# EAGLE design Adafruit Feather RP2040 USB Host (EAGLE 9.6.2)
COMPANY: ADAFRUIT INDUSTRIES; DRAWN: KTOWN; REV: B

## Sheet 1 of 2
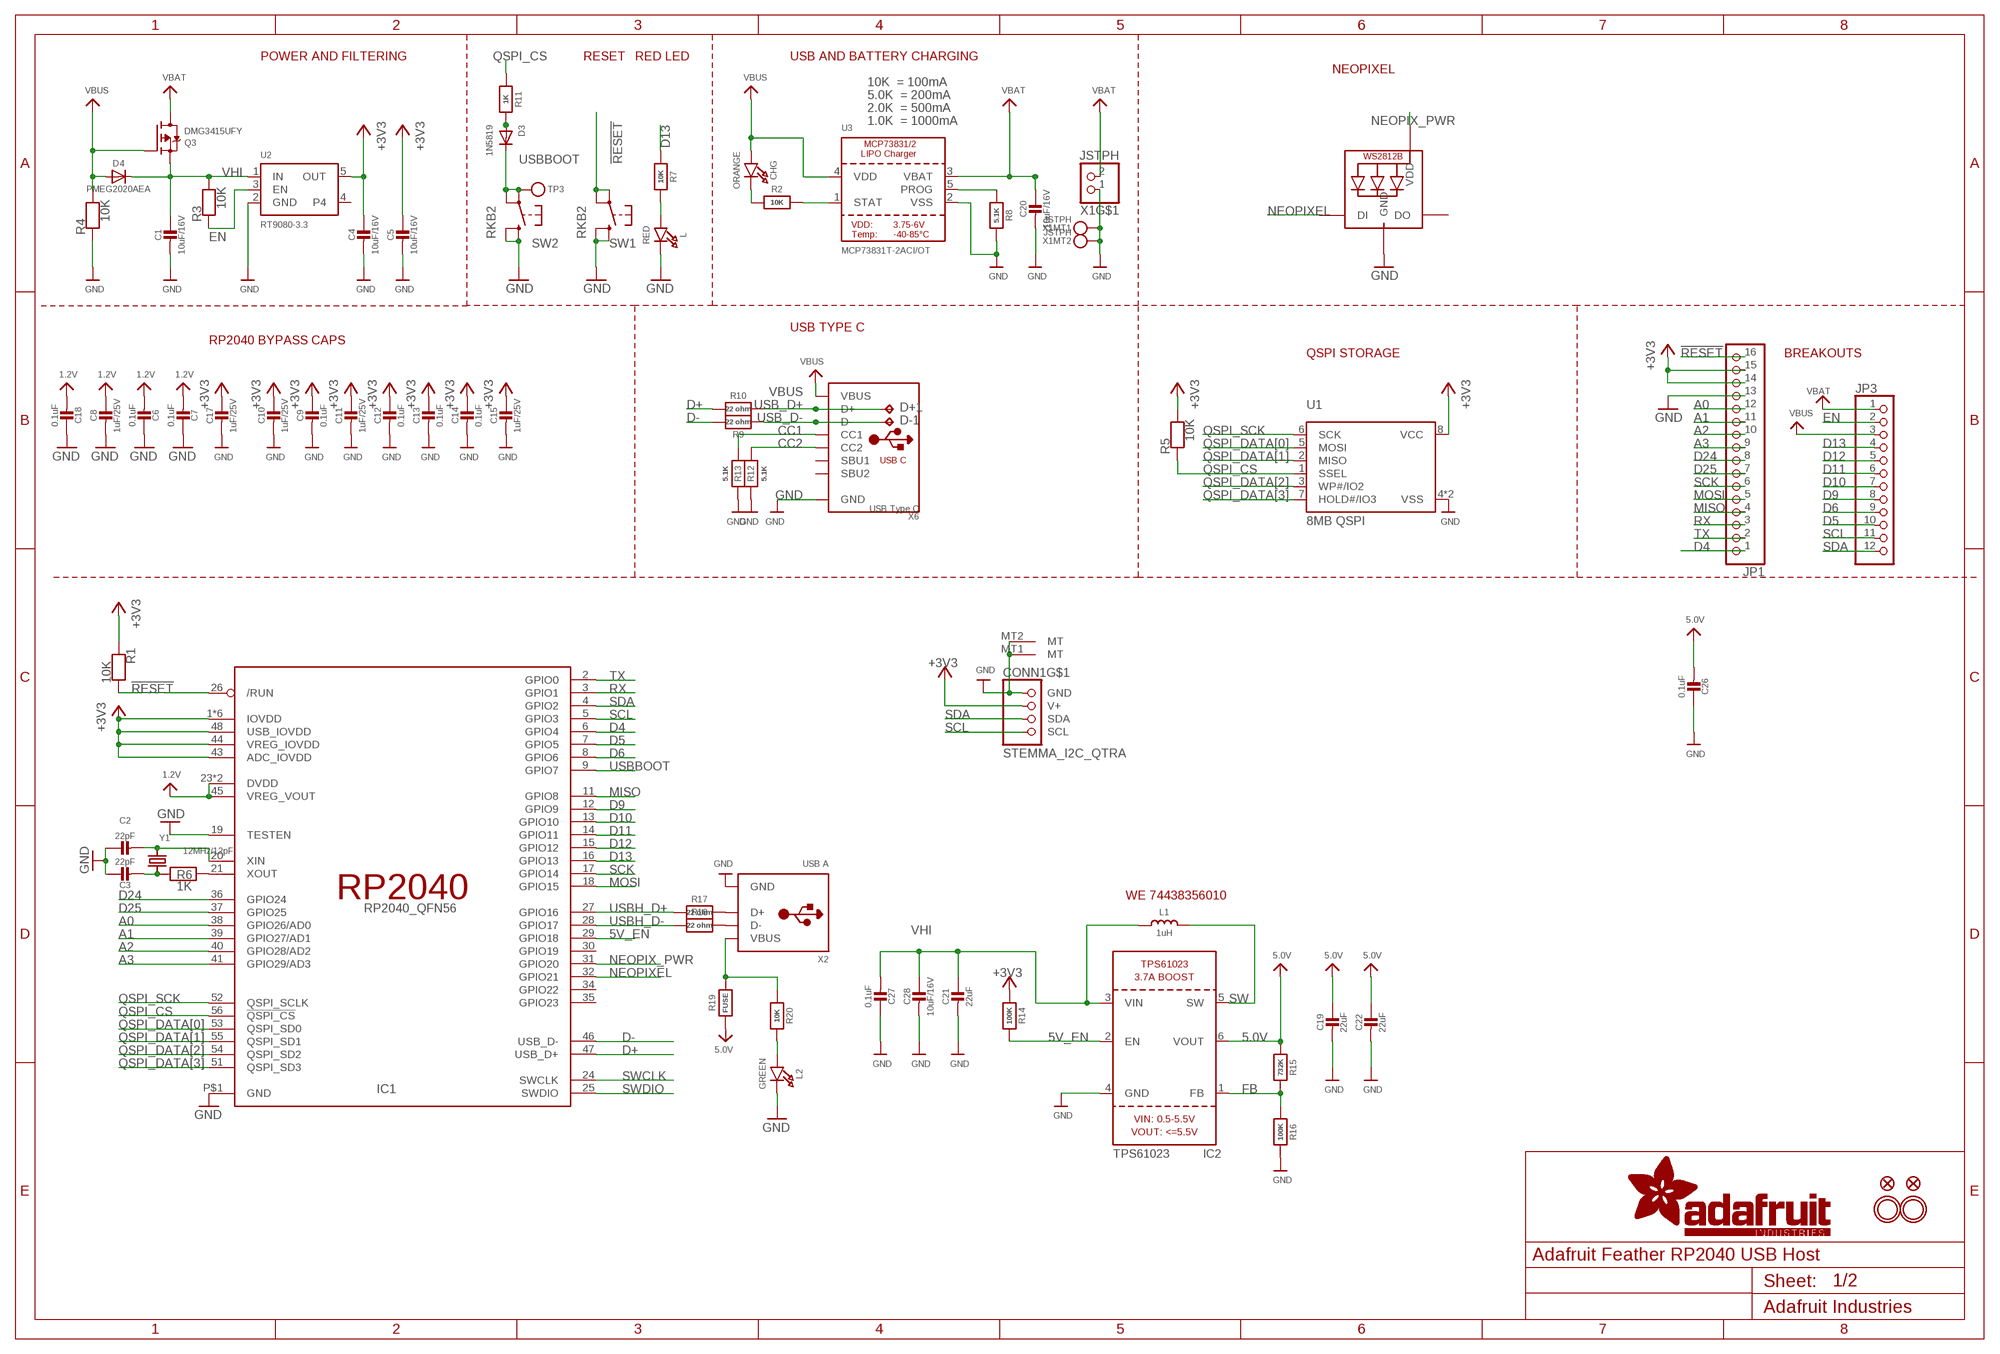
[diagram p0: schematic, sheet 1]

### Parts
C1  10uF/16V  CAP_CERAMIC0805-NOOUTLINE  [0805-NO]
C2  22pF  CAP_CERAMIC_0402NO  [_0402NO]
C3  22pF  CAP_CERAMIC_0402NO  [_0402NO]
C4  10uF/16V  CAP_CERAMIC0805-NOOUTLINE  [0805-NO]
C5  10uF/16V  CAP_CERAMIC0805-NOOUTLINE  [0805-NO]
C6  0.1uF  CAP_CERAMIC_0402NO  [_0402NO]
C7  0.1uF  CAP_CERAMIC_0402NO  [_0402NO]
C8  1uF/25V  CAP_CERAMIC_0402NO  [_0402NO]
C9  0.1uF  CAP_CERAMIC_0402NO  [_0402NO]
C10  1uF/25V  CAP_CERAMIC_0402NO  [_0402NO]
C11  1uF/25V  CAP_CERAMIC_0402NO  [_0402NO]
C12  0.1uF  CAP_CERAMIC_0402NO  [_0402NO]
C13  0.1uF  CAP_CERAMIC_0402NO  [_0402NO]
C14  0.1uF  CAP_CERAMIC_0402NO  [_0402NO]
C15  1uF/25V  CAP_CERAMIC_0402NO  [_0402NO]
C17  1uF/25V  CAP_CERAMIC_0402NO  [_0402NO]
C18  0.1uF  CAP_CERAMIC_0402NO  [_0402NO]
C19  22uF  CAP_CERAMIC0805-NOOUTLINE  [0805-NO]
C20  10uF/16V  CAP_CERAMIC0805-NOOUTLINE  [0805-NO]
C21  22uF  CAP_CERAMIC0805-NOOUTLINE  [0805-NO]
C22  22uF  CAP_CERAMIC0805-NOOUTLINE  [0805-NO]
C26  0.1uF  CAP_CERAMIC_0402NO  [_0402NO]
C27  0.1uF  CAP_CERAMIC_0402NO  [_0402NO]
C28  10uF/16V  CAP_CERAMIC0805-NOOUTLINE  [0805-NO]
CHG  ORANGE  LED0603_NOOUTLINE  [CHIPLED_0603_NOOUTLINE]
CONN1  STEMMA_I2C_QTRA  [JST_SH4_RA]
D3  1N5819  DIODE_SOD323MINI  [SOD-323_MINI]
D4  PMEG2020AEA  DIODESOD-323F  [SOD-323F]
D+1  TPB1,27  [B1,27]
D-1  TPB1,27  [B1,27]
IC1  RP2040_QFN56  [QFN56_7MM_REDUCEDEPAD]
IC2  TPS61023  [SOT563]
JP1  HEADER-1X16ROUND  [1X16_ROUND]
JP3  HEADER-1X12  [1X12_ROUND]
L  RED  LED0603_NOOUTLINE  [CHIPLED_0603_NOOUTLINE]
L1  1uH  INDUCTOR_5045_SMALLTABS  [INDUCTOR_5045_SMALLTABS]
L2  GREEN  LED0603_NOOUTLINE  [CHIPLED_0603_NOOUTLINE]
LED1  WS2812B_SK6805_1515  [SK6805_1515]
Q3  DMG3415UFY  MOSFET-P_DFN2015  [DFN2015-3]
R1  10K  RESISTOR_0402NO  [_0402NO]
R2  10K  RESISTOR_0402NO  [_0402NO]
R3  10K  RESISTOR_0402NO  [_0402NO]
R4  10K  RESISTOR_0402NO  [_0402NO]
R5  10K  RESISTOR_0402NO  [_0402NO]
R6  1K  RESISTOR_0402NO  [_0402NO]
R7  10K  RESISTOR_0402NO  [_0402NO]
R8  5.1K  RESISTOR_0402NO  [_0402NO]
R9  22 ohm  RESISTOR_0402NO  [_0402NO]
R10  22 ohm  RESISTOR_0402NO  [_0402NO]
R11  1K  RESISTOR_0402NO  [_0402NO]
R12  5.1K  RESISTOR_0402NO  [_0402NO]
R13  5.1K  RESISTOR_0402NO  [_0402NO]
R14  100K  RESISTOR_0402NO  [_0402NO]
R15  732K  RESISTOR_0402NO  [_0402NO]
R16  100K  RESISTOR_0402NO  [_0402NO]
R17  22 ohm  RESISTOR_0402NO  [_0402NO]
R18  22 ohm  RESISTOR_0402NO  [_0402NO]
R19  FUSE  RESISTOR0805_NOOUTLINE  [0805-NO]
R20  10K  RESISTOR_0402NO  [_0402NO]
SW1  RKB2  SWITCH_TACT_SMT_RKB2  [BTN_RKB2_4.6X2.8]
SW2  RKB2  SWITCH_TACT_SMT_RKB2  [BTN_RKB2_4.6X2.8]
TP3  TESTPOINTROUND1.5MMNO  [TESTPOINT_ROUND_1.5MM_NO]
U1  8MB QSPI  SPIFLASH_8PIN_4X4  [USON8_4X4]
U2  RT9080-3.3  VREG_SOT23-5  [SOT23-5]
U3  MCP73831T-2ACI/OT  MCP73831/2  [SOT23-5]
U$31  MOUNTINGHOLE2.5  [MOUNTINGHOLE_2.5_PLATED]
U$32  MOUNTINGHOLE2.5  [MOUNTINGHOLE_2.5_PLATED]
U$34  FIDUCIAL_1MM  [FIDUCIAL_1MM]
U$35  FIDUCIAL_1MM  [FIDUCIAL_1MM]
X1  JSTPH  CON_JST_PH_2PIN_MT_BATT  [JSTPH2_BATT]
X2  USB A  USB_TYPEA_SMT  [USB_HOST-SMT]
X6  USB Type C  USB_C  [USB_C_CUSB31-CFM2AX-01-X]
Y1  12MHz/12pF  CRYSTAL2.5X2.0  [CRYSTAL_2.5X2]

### Nets
1.2V: C6.2 C7.2 C8.1 C18.2 IC1.23(DVDD) IC1.45(VREG_VOUT) IC1.50(DVDD)
5.0V: C19.1 C22.1 C26.2 IC2.6(VOUT) R15.1 R19.2
5V_EN: IC1.29(GPIO18) IC2.2(EN) R14.2
!RESET: IC1.26(/RUN) JP1.16 R1.2 SW1.A'(P1) SW1.A(P)
+3V3: C4.1 C5.1 C9.1 C10.1 C11.1 C12.1 C13.1 C14.1 C15.1 C17.1 CONN1.2(V+) IC1.1(IOVDD) IC1.10(IOVDD) IC1.22(IOVDD) IC1.33(IOVDD) IC1.42(IOVDD) IC1.43(ADC_IOVDD) IC1.44(VREG_IOVDD) IC1.48(USB_IOVDD) IC1.49(IOVDD) JP1.14 JP1.15 R1.1 R5.2 R14.1 U1.8(VCC) U2.5(OUT)
A0: IC1.38(GPIO26/AD0) JP1.12
A1: IC1.39(GPIO27/AD1) JP1.11
A2: IC1.40(GPIO28/AD2) JP1.10
A3: IC1.41(GPIO29/AD3) JP1.9
CC1: R13.2 X6.A5(CC1)
CC2: R12.2 X6.B5(CC2)
D4: IC1.6(GPIO4) JP1.1
D5: IC1.7(GPIO5) JP3.10
D6: IC1.8(GPIO6) JP3.9
D9: IC1.12(GPIO9) JP3.8
D10: IC1.13(GPIO10) JP3.7
D11: IC1.14(GPIO11) JP3.6
D12: IC1.15(GPIO12) JP3.5
D13: IC1.16(GPIO13) JP3.4 R7.1
D24: IC1.36(GPIO24) JP1.8
D25: IC1.37(GPIO25) JP1.7
D+: IC1.47(USB_D+) R10.2
D-: IC1.46(USB_D-) R9.2
EN: JP3.2 R3.1 U2.3(EN)
FB: IC2.1(FB) R15.2 R16.1
GND [power]: C1.2 C2.1 C3.1 C4.2 C5.2 C6.1 C7.1 C8.2 C9.2 C10.2 C11.2 C12.2 C13.2 C14.2 C15.2 C17.2 C18.1 C19.2 C20.2 C21.2 C22.2 C26.1 C27.1 C28.2 CONN1.1(GND) CONN1.MT1(MT) CONN1.MT2(MT) IC1.19(TESTEN) IC1.P$1(GND) IC2.4(GND) JP1.13 L2.C L.C LED1.4(GND) R4.1 R8.2 R12.1 R13.1 R16.2 SW1.B'(S1) SW1.B(S) SW2.B'(S1) SW2.B(S) U1.4(VSS) U1.PAD(VSS) U2.2(GND) U3.2(VSS) X1.1 X1.NC1 X1.NC2 X2.GND X6.A1B12(GND) X6.B1A12(GND)
MISO: IC1.11(GPIO8) JP1.4
MOSI: IC1.18(GPIO15) JP1.5
N$1: CHG.C R2.1
N$2: L.A R7.2
N$3: R2.2 U3.1(STAT)
N$4: R8.1 U3.5(PROG)
N$5: C2.2 IC1.20(XIN) Y1.3
N$6: C3.2 R6.1 Y1.1
N$7: IC1.21(XOUT) R6.2
N$8: R17.1 X2.D+
N$9: R18.1 X2.D-
N$10: R19.1 R20.1 X2.VBUS
N$11: L2.A R20.2
N$16: D3.A R11.2
NEOPIX_PWR: IC1.31(GPIO20) LED1.2(VDD)
NEOPIXEL: IC1.32(GPIO21) LED1.1(DI)
QSPI_CS: IC1.56(!QSPI_CS) R5.1 R11.1 U1.1(SSEL)
QSPI_DATA[0]: IC1.53(QSPI_SD0) U1.5(MOSI)
QSPI_DATA[1]: IC1.55(QSPI_SD1) U1.2(MISO)
QSPI_DATA[2]: IC1.54(QSPI_SD2) U1.3(WP#/IO2)
QSPI_DATA[3]: IC1.51(QSPI_SD3) U1.7(HOLD#/IO3)
QSPI_SCK: IC1.52(QSPI_SCLK) U1.6(SCK)
RX: IC1.3(GPIO1) JP1.3
SCK: IC1.17(GPIO14) JP1.6
SCL: CONN1.4(SCL) IC1.5(GPIO3) JP3.11
SDA: CONN1.3(SDA) IC1.4(GPIO2) JP3.12
SW: IC2.5(SW) L1.2
SWCLK: IC1.24(SWCLK)
SWDIO: IC1.25(SWDIO)
TX: IC1.2(GPIO0) JP1.2
USB_D+: D+1.TP R10.1 X6.A6(D+) X6.B6(D+)
USB_D-: D-1.TP R9.1 X6.A7(D-) X6.B7(D-)
USBBOOT: D3.C IC1.9(GPIO7) SW2.A'(P1) SW2.A(P) TP3.P$1
USBH_D+: IC1.27(GPIO16) R17.2
USBH_D-: IC1.28(GPIO17) R18.2
VBAT [power]: C20.1 JP3.1 Q3.3(D) U3.3(VBAT) X1.2
VBUS [power]: CHG.A D4.A JP3.3 Q3.1(G) R4.2 U3.4(VDD) X6.A4B9(VBUS) X6.B4A9(VBUS)
VHI: C1.1 C21.1 C27.2 C28.1 D4.C IC2.3(VIN) L1.1 Q3.2(S) R3.2 U2.1(IN)
Unconnected: IC1.30(GPIO19) IC1.34(GPIO22) IC1.35(GPIO23) LED1.3(DO) U2.4 X6.A8(SBU1) X6.B8(SBU2)

### Notes on the sheet
- POWER AND FILTERING | RESET | RED LED | USB AND BATTERY CHARGING
- NEOPIXEL
- 10K  = 100mA
- 5.0K  = 200mA
- 2.0K  = 500mA
- 1.0K  = 1000mA
- USB TYPE C
- RP2040 BYPASS CAPS
- QSPI STORAGE | BREAKOUTS
- WE 74438356010

## Sheet 2 of 2

## Library data of the parts
C1-C3 C5-C15 C17-C22 C26-C28 = microbuilder:CAP_CERAMIC: Ceramic Capacitors For new designs, use the packages preceded by an '_' character since they are more reliable: The following footprints should be used on most boards: _0402 - Standard footprint for regular board layouts _0603 - Standard footprint for regular board layouts _0805 - Standard footprint for regular board layouts _1206 - Standard footprint for regular board layouts For extremely tight-pitch boards where space is at a premium, the following 'micro-pitch' footprints can be used (smaller pads, no silkscreen outline, etc.): _0402MP - Micro-pitch footprint for very dense/compact boards _0603MP - Micro-pitch footprint for very dense/compact boards _0805MP - Micro-pitch footprint for very dense/compact boards _1206MP - Micro-pitch footprint for very dense/compact boards
C4 = microbuilder:CAP_CERAMIC: Ceramic Capacitors For new designs, use the packages preceded by an '_' character since they are more reliable: The following footprints should be used on most boards: _0402 - Standard footprint for regular board layouts _0603 - Standard footprint for regular board layouts _0805 - Standard footprint for regular board layouts _1206 - Standard footprint for regular board layouts For extremely tight-pitch boards where space is at a premium, the following 'micro-pitch' footprints can be used (smaller pads, no silkscreen outline, etc.): _0402MP - Micro-pitch footprint for very dense/compact boards _0603MP - Micro-pitch footprint for very dense/compact boards _0805MP - Micro-pitch footprint for very dense/compact boards _1206MP - Micro-pitch footprint for very dense/compact boards; REV: A
CHG L L2 = microbuilder:LED: LED 0603 - 0603 Surface Mount Package 2mA: Green LED - Low Power (3.9mcd, 2ma, 1.7Vf) - Digikey: 475-2709-2-ND Orange LED - Low Power (9.8mcd, 2ma, 1.8Vf) - Digikey: 475-1194-2-ND Red LED - Low Power (5mcd, 2ma, 1.8Vf) - Digikey: 475-1195-2-ND Yellow LED - Low Power (7mcd, 2ma, 1.8Vf) - Digikey: 475-1196-2-ND 5mA: Blue LED - Low Power (17mcd, 5ma, 2.9Vf) - Digikey: LNJ937W8CRACT-ND 0805 - 0805 Surface Mount Package 2mA: Red LED (8.8mcd, 2mA, 1.8Vf, Clear) - Low Power [Digikey: 475-2510-1-ND] Green LED (5mcd, 2mA, 1.8Vf, Clear) - Low Power [Digikey: 475-2730-1-ND] Yellow LED (11.3mcd, 2mA, 1.8Vf, Clear) - Low Power [Digikey: 475-2555-1-ND] 20mA: Red LED (104mcd, 20mA, Diffused) - LS R976 [Digikey: 475-1278-6-ND] Red LED (12mcd, 20mA, 2.0Vf, Clear) - APT2012EC [Digikey: 754-1128-1-ND] Green LED (15mcd, 20mA, 2.2Vf, Clear) - APT2012GC [Digikey: 754-1131-1-ND] Orange LED (160mcd, 20mA, 2.1Vf, Clear) - APT2012SECK [Digikey: 754-1130-1-ND] 1206 - 1206 Surface Mount Package Green LED (26mcd, 20mA, Diffused) - LG N971 [Digikey: 475-1407-6-ND] Red LED (15mcd, 20mA, Diffused) - LH N974 [Digikey: 475-1416-6-ND] Cree - Cree High-Power Surface Mount LEDs XPEBWT-L1-0000-00D50 - White 111lm 350mA 2.9Vf 6200K 110° XTEAWT-00-0000-00000LEE3 - White 114lm 350mA 2.85Vf 5000K 115° Everlight - Everlight 45-21 Series Surface Mount LEDs 45-21/QK2C-B2832AC2CB2/2T - Warm White 2000mcd 20mA 3.25Vf 3050K 120° 45-21/LK2C-B38452C4CB2/2T - Nuetral White 2000mcd 20mA 3.25Vf 4150K 120° 45-21/LK2C-B50634C6CB2/2T - Cold White 2200mcd 20mA 3.25Vf 5650K 120° PLCC2 Reverse Mount LS T77K-J1L2-1-0-2-R18-Z - Red 11.25mcd 2mA 1.8Vf 630nm 120° LO T77K-L1M2-24-Z - Orange 19.6mcd 2mA 1.8Vf 606nm 120° LY T77K-K2M1-26-Z - Yellow 15.7mcd 2mA 1.8Vf 587nm 120°; ROT: 270
CONN1 = adafruit_electromech:STEMMA_I2C; LCSC: C145961
D3 = microbuilder:DIODE: Diode
D4 = adafruit:DIODE: Diode
D+1 D-1 = testpad:TP: Test pad
IC1 = adafruit_micro:RP2040; LCSC: C2040
IC2 = adafruit_power:TPS61023; ROT: 180
JP1 = microbuilder:HEADER-1X16: PIN HEADER
JP3 = microbuilder:HEADER-1X12
L1 = microbuilder:INDUCTOR: Inductors 0603: 10nH Ceramic Inductor - microwire antenna/RF (Digikey: 712-1434-2-ND) 0805: 560nH Ceramic Inductor - RF (Digikey: 553-1047-1-ND) 270nH Ceramic Inductor - Q = 40@250MHz, +-5%, 1 Ohm DC Resistance (Digikey: 535-10506-2-ND) 1007 (2518 Metric) SMT: 10µH 10% 250mOhm 820mA 1007 Inductor (Digikey: 587-2189-1-ND) 22µH 10% 500mOhm 580mA 1007 Inductor (Digikey: 587-2190-1-ND) 47µH 10% 950mOhm 420mA 1007 Inductor (Digikey: 587-2191-1-ND) 47µH 5% 100mOhm 1A 1008 Inductor (Digikey: 732-1816-1-ND) 5.0x5.0mm (Taiyo Yuden NR5040 Series) 6.8µH 20% 2.3A 64mOhm Inductor (Digikey: 587-2374-2-ND) 5.0x5.0mm (TDK VLC5045 Series) 4.7µH 20% 3.3A 34mOhm Inductor (Digikey: 445-6526-1-ND) 6.8µH 20% 2.7A 46mOhm Inductor (Digikey: 445-6527-1-ND) 6.0x6.0mm (TDK VLC6045 Series) 4.7µH 20% 3.8A 27mOhm Inductor (Digikey: 445-6538-2-ND) 6.8µH 20% 3A 41mOhm Inductor (Digikey: 445-6540-1-ND) 6.2µH 30% 2.2A 45mOhm Inductor (Digikey: SRR5028-6R2YCT-ND) - Not TDK VLC6045 but footprint should match 6.0x6.0mm (TDK SLF6045 Series) 6.8uH 30% 2A 33mOhm Inductor (Digikey: 445-4572-1-ND, Mouser: 810-SLF645T6R8N2R0PF) 6.0x6.0mm (Sumida CDRH5D28 Series) 6.2uH 30% 1.8A 45mOhm Inductor (Digikey: 308-1542-1-ND) Taiyo Yuden NR3015T2R2M - 2.2uH 20% 1.5A (Digikey: 587-1648-2-ND, Mouser: 963-NR3015T2R2M) - Used with TI TPS62172 CoilCraft RFID Transponder Coil - MA5532-AE (For use with AS3935 Lightning Sensor) Taiyo Yuden NRH2412T2R2MNGH - 2.2uH 20% 1AA (Digikey: 587-3443-1-ND) - Used with TI LM3671 Vishay IHLP 1.0uH Molded Inductor - 24mOhm DCR, 5A, +/-20%, -55°C-125°C (Digikey: 541-1319-1-ND)
LED1 = microbuilder:WS2812B; LCSC: C2890035
Q3 = microbuilder:MOSFET-P: P-Channel Mosfet LEGEND VDS: Voltage Drain-Source ID: Drain Current RDS(ON): Drain-Source On-State Resistance VGS(TH): Gate-Source Threshold Voltage CISS: Drain-Source Input Capacitance SOT-23 Name VDS ID RDS(ON) VGS(TH) CISS Order Number IRLML5103 30V 760mA 600 mOhm -- 75pF @ 25V Digikey: IRLML5103PBFCT-ND IRLML6401 12V 4.3A 50 mOhm 950mV @ 250µA 830pF @ 10V Digikey: IRLML6401PBFTR-ND NTR0202PL 20V 400mA 800 mOhm 2.3V @ 250uA 70pF @ 5V Digikey: NTR0202PLT1GOSTR-ND NTR4101PT1G 20V 1.8A 85 mOhm 1.2V @ 250uA 675pF @ 10V Digikey: NTR4101PT1GOSCT-ND DMP2004K 20V 600mA 900 mOhm 1V @ 250uA 175pF @ 16V Digikey: DMP2004KDICT-ND PMV65XP 20V 3.9A 76 mOhm 950mV @ 1mA 725pF @ 20V Digikey: 568-2358-2-ND TO-252 Name VDS ID RDS(ON) VGS(TH) CISS Order Number AOD417 30V 25A 34 mOhm 3V @ 250µA 920pF @ 15V Digikey: 785-1106-2-ND PowerPak Name VDS ID RDS(ON) VGS(TH) CISS Order Number AON7401 30V 12A 14 mOhm 3V @ 250µA 2600pF @ 15V Digikey: 785-1302-1-ND
R1-R20 = microbuilder:RESISTOR: Resistors For new designs, use the packages preceded by an '_' character since they are more reliable: The following footprints should be used on most boards: _0402 - Standard footprint for regular board layouts _0603 - Standard footprint for regular board layouts _0805 - Standard footprint for regular board layouts _1206 - Standard footprint for regular board layouts For extremely tight-pitch boards where space is at a premium, the following 'micro-pitch' footprints can be used (smaller pads, no silkscreen outline, etc.): _0402MP - Micro-pitch footprint for very dense/compact boards _0603MP - Micro-pitch footprint for very dense/compact boards _0805MP - Micro-pitch footprint for very dense/compact boards _1206MP - Micro-pitch footprint for very dense/compact boards
SW1 SW2 = adafruit_electromech:SWITCH_TACT_SMT: SMT Tact Switches RKB2 https://www.digikey.com/short/m027prz5
TP3 = microbuilder:TESTPOINT: Test Point Various test points for characterisation and PCB testing TESTPOINT_SMT - Compact Surface Mount Test Point [Digikey: 5016KTR-ND]
U1 = microbuilder:SPIFLASH_8PIN: SOIC8 SPI Flash Be careful with the size since SOIC8 flash comes in several 'widths' SOIC8 150 mil M25P16 - 16Mbit (2Mbit x 8) Serial Flash (75MHz SPI Bus), Supply: 2.7-3.6V Digikey: SOIC8 - M25P16-VMN6P-ND SOIC8 208 mil W25Q16BVSSIG - 16Mbit (2Mbit x 8) Serial Flash (104MHz SPI Bus), Supply: 2.7-3.6V Digikey: SOIC8 - W25Q16BVSSIG-ND
U2 = adafruit_power:VREG_SOT23-5: SOT23-5 Fixed Voltage Regulators Part Current Out V Out V In V Dropout θJA (°C/W) TJ (°C) Digikey Part No. ADP121 150mA 3.3V 3.4-5.5V 0.09V @ 150mA -- -- ADP121-AUJZ33R7CT-ND ADP121 150mA 3.0V 3.1-5.5V 0.09V @ 150mA -- -- ADP121-AUJZ30R7CT-ND ADP122 300mA 3.3V 3.4-5.5V 0.085V @ 300mA -- -- ADP122AUJZ-3.3-R7CT-ND ADP1712 300mA 3.3V 3.5-5.5V 0.17V @ 300mA -- -- ADP1712AUJZ-3.3-R7TR-ND AP7311 (Low Cost) 150mA 3.3V 3.5-6V 0.15V @ 150mA -- -- AP7311-33WG-7DICT-ND LD39015M18R 150mA 1.8V 1.9V-5.5V 0.08V @ 100mA -- -- 497-6977-1-ND LP2985A-33DBVR 150mA 3.3V 3.3-16V 0.28V @ 150mA 206 150 296-18479-1-ND MCP1824T-3302E/OT 300mA 3.3V 3.5V-6V 0.2V @ 300mA -- -- MCP1824T-3302E/OTCT-ND MIC5205-2.5YM5 TR 150mA 2.5V 2.7-16V 0.165V @ 150mA -- -- 576-1257-2-ND MIC5205-3.0YM5 TR 150mA 3.0V 3.2V-16V 0.165V @ 150mA -- -- 576-1258-2-ND MIC5205-3.3YM5 TR 150mA 3.3V 3.5V-16V 0.165V @ 150mA -- -- 576-1259-2-ND TPS780330220 150mA 3.3V+2.2V 3.6-5.5V 250mV Max -- -- 296-23332-1-ND TDA3663/N1,135 100mA 3.3V 3.5-45V 0.18V @ 50mA -- -- 568-5343-1-ND Max operating temp can be calculated using θJA, TJ (max junction temperature), and power in watts. Set the "Maximum Ambient Temperature" until it reaches TJ ("Max Junction Temperature"), which is the absolute limit for safe use of the regulator: Heat Sink Temperature Calculator <http://www.daycounter.com/Calculators/Heat-Sink-Temperature-Calculator.phtml> For example, With 12V source into a 3.3V LP2985 and a 30mA load, we are dissipating (12V-3.3V) * 0.03A = 0.261W. With a θJA of 206 °C/W, a TJ of 150°C, and 261mW we can safely use the chip without a heat sink up to 75°C (=147.1°C Junction Temperature).; JLC_ROTATION: 0
U3 = microbuilder:MCP73831/2: MCP73831/2 LIPO Charger VDD: 3.75 - 6V Temp -40 - 85°C Programmable Charge Rate: 15-500mA NOTE: STAT is a tri-state logic output on the MCP73831 and an open-drain output on the MCP73832. SOT23-5 with 4.2V output and tri-state logic on STAT = MCP73831T-2ACI/OT; JLC_ROTATION: 270; LCSC: C424093
U$31 U$32 = adafruit_electromech:MOUNTINGHOLE: Mounting Hole For #2 screws (0.086"/2.18mm width, 0.094"/2.4mm hole) use 2.5mm; BOM: EXCLUDE
U$34 U$35 = microbuilder:FIDUCIAL: Fiducial Alignment Points Various fiducial points for machine vision alignment.; BOM: EXCLUDE
X1 = adafruit_electromech:CON_JST_PH_2PIN_MT; LCSC: C47647
X2 = adafruit_electromech:USB_TYPEA: USB - Type A Connectors Male types stick out and are inserted into a PC or matching females parts (these are the connectors used on USB Memory Sticks, etc.). Female parts are generally used for USB Host and accept a male-type connector. SMT - 4UCON: 10017 PTHFML - Digikey: 609-1045-ND, 4UCon: 05241 PCB - Use 2.0mm thick PCBs with this footprint
X6 = adafruit_electromech:USB_C: USB Type-C USB 2.0 Connector; LCSC: C165948
Y1 = microbuilder:CRYSTAL: Crystals HC49UP - Surface Mount Crystal 4.0MHz 18pF +/-30ppm Surface Mount Crystal [Digikey: 535-9857-1-ND] 12.0 MHz Surface Mount Crystal [Digikey: 535-9869-6-ND] 25.0 MHz Surface Mount Crystal [Digikey: 535-9078-1-ND] 2.5 x 2.0mm - MEMs SMT Crystal 16.0 MHz 10pF 20ppm 2.5 x 2.0mm Crystal [Digikey -40-85°C: 535-10923-1-ND] 3.2 x 2.5mm - MEMs SMT Crystal 12.0 MHz 8pF 15ppm 3.2 x 2.5mm Crystal [Digikey: -10-70°C: 644-1047-1-ND -40-125°C: 644-1128-1-ND] 40~85°C cheaper: 644-1173-6-ND 16.0 MHz 8pF 15ppm 3.2 x 2.5mm Crystal [Digikey: -10-70°C: 644-1049-1-ND -40-125°C: 644-1129-2-ND]-40~85°C cheaper: 644-1175-6-ND 16.0 MHz 10pF 10ppm 3.2 x 2.5mm Crystal [Digikey: 644-1100-1-ND] 27.12 MHz 18pF 30ppm 3.2 x 2.5mm Crystal [Digikey: 887-1424-1-ND] 27.12MHz 10pF 10ppm 3.2 x 2.5mm Crystal [Digikey: 887-1329-1-ND] 4.9 x 1.8mm - MEMs SMT Crystal 32.768 KHz 12.5pF 20ppm 4.9 x 1.8mm Crystal [Digikey: SE2415CT-ND] 8.0 x 3.8mm - Surface Mount Crystal 32.768kHz 12.5pF 20ppm -40°C-85°C [Digikey: 535-9166-2-ND] Cylinder 32.768KHz Cylinder Crystal (2x6mm body) [Ex. Digikey: 300-8341-2-ND]

## Net classes
1 power: width 0.305 mm
2 lowpower: width 0.254 mm, drill 0.381 mm

## Board
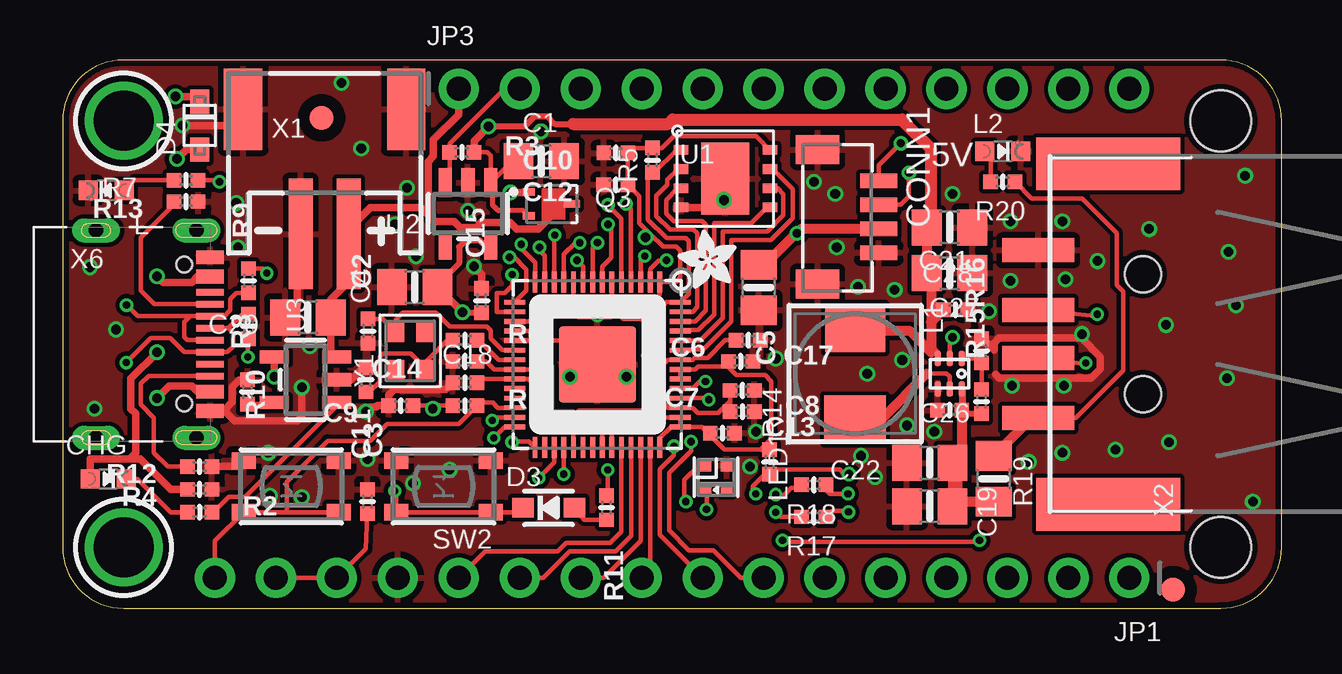
[diagram p1: board, top side]
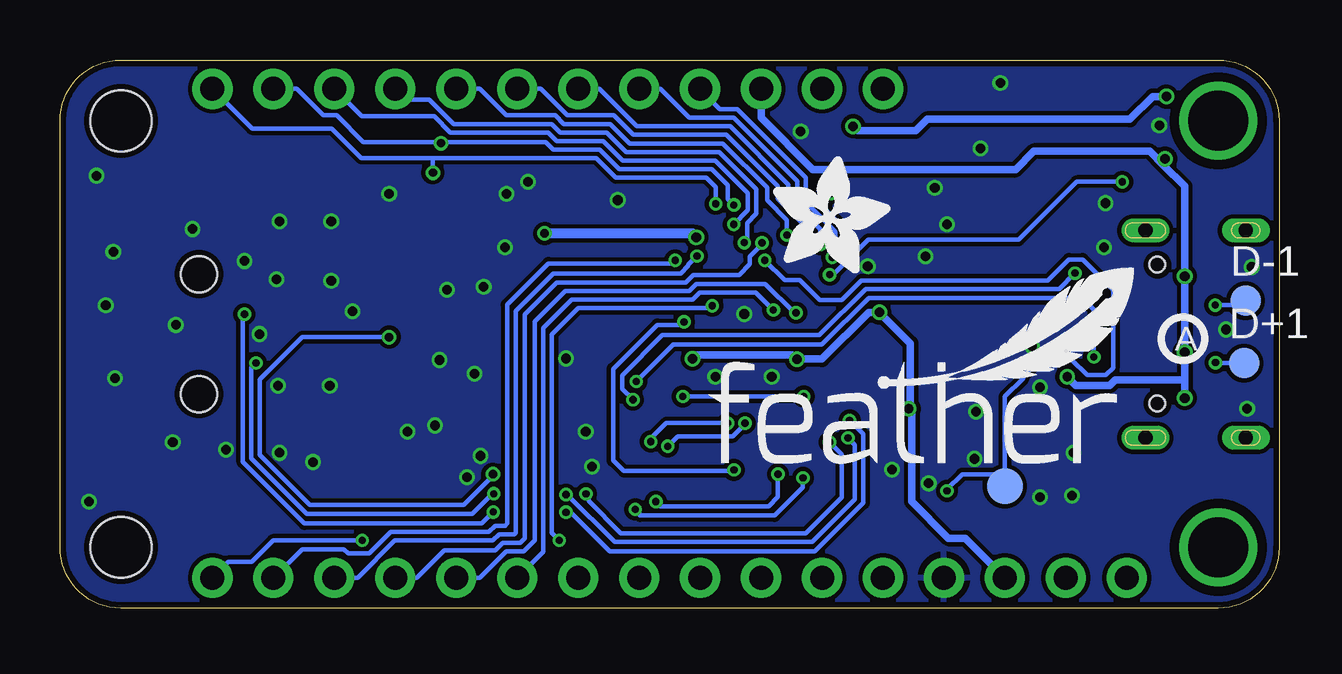
[diagram p2: board, bottom side, seen from below]

Size 50.8 x 22.86 mm. Coordinates in mm from the lower left corner, seen from the top.
Outline: 2.54,0 48.26,0 arc90 50.8,2.54 50.8,20.32 arc90 48.26,22.86 2.54,22.86 arc90 0,20.32 0,2.54 arc90 2.54,0
Copper layers (1*16): Top 0.035mm / dielectric 1.5mm / Bottom 0.035mm
Design rules "adafruit 7-7 *": minimum track width 7mil, minimum drill 8mil, track to track 7mil, track to pad 7mil, pad to pad 7mil, via to via 7mil, smd to smd 7mil, copper to edge 10mil, drill to drill 8mil, minimum pad ring 7mil, minimum via ring 5mil, stop-mask expansion 2mil, vias tented up to drill 20mil, thermal gap 10mil
Holes 2.54 mm at 48.26,20.32 48.26,2.54

### Footprints (pad centres in the part's own frame; a part is rotated, then mirrored left to right if it is on the bottom)
0805-NO = smd 1.24 x 1.5: 1 -0.95,0; 2 0.95,0
_0402NO = smd 0.6 x 0.6: 1 -0.508,0; 2 0.508,0
CHIPLED_0603_NOOUTLINE = smd 0.8 x 0.8: A 0,-0.75; C 0,0.75
JST_SH4_RA = smd 0.6 x 1.55: 1 1.5,0.924; 2 0.5,0.924; 3 -0.5,0.924; 4 -1.5,0.924 | smd 1.2 x 1.8: MT1 -2.8,-1.624; MT2 2.8,-1.624
SOD-323_MINI = smd 0.9 x 0.8: A 1.07,0; C -1.07,0
SOD-323F = smd 1 x 0.8: A -1,0; C 1,0
B1,27 = smd 1.27 x 1.27: TP 0,0
QFN56_7MM_REDUCEDEPAD = smd 0.875 x 0.2: 1 -3.45,2.6; 2 -3.45,2.2; 3 -3.45,1.8; 4 -3.45,1.4; 5 -3.45,1; 6 -3.45,0.6; 7 -3.45,0.2; 8 -3.45,-0.2; 9 -3.45,-0.6; 10 -3.45,-1; 11 -3.45,-1.4; 12 -3.45,-1.8; 13 -3.45,-2.2; 14 -3.45,-2.6; 29 3.45,-2.6; 30 3.45,-2.2; 31 3.45,-1.8; 32 3.45,-1.4; 33 3.45,-1; 34 3.45,-0.6; 35 3.45,-0.2; 36 3.45,0.2; 37 3.45,0.6; 38 3.45,1; 39 3.45,1.4; 40 3.45,1.8; 41 3.45,2.2; 42 3.45,2.6 | smd 0.2 x 0.875: 15 -2.6,-3.45; 16 -2.2,-3.45; 17 -1.8,-3.45; 18 -1.4,-3.45; 19 -1,-3.45; 20 -0.6,-3.45; 21 -0.2,-3.45; 22 0.2,-3.45; 23 0.6,-3.45; 24 1,-3.45; 25 1.4,-3.45; 26 1.8,-3.45; 27 2.2,-3.45; 28 2.6,-3.45; 43 2.6,3.45; 44 2.2,3.45; 45 1.8,3.45; 46 1.4,3.45; 47 1,3.45; 48 0.6,3.45; 49 0.2,3.45; 50 -0.2,3.45; 51 -0.6,3.45; 52 -1,3.45; 53 -1.4,3.45; 54 -1.8,3.45; 55 -2.2,3.45; 56 -2.6,3.45 | smd 3.2 x 3.2: P$1 0,0
SOT563 = smd 0.65 x 0.275: 1 -0.635,0.5; 2 -0.635,0; 3 -0.635,-0.5; 4 0.635,-0.5; 5 0.635,0; 6 0.635,0.5
1X16_ROUND = drill 1 pad 1.676: 1 -19.05,0; 2 -16.51,0; 3 -13.97,0; 4 -11.43,0; 5 -8.89,0; 6 -6.35,0; 7 -3.81,0; 8 -1.27,0; 9 1.27,0; 10 3.81,0; 11 6.35,0; 12 8.89,0; 13 11.43,0; 14 13.97,0; 15 16.51,0; 16 19.05,0
1X12_ROUND = drill 1 pad 1.676: 1 -13.97,0; 2 -11.43,0; 3 -8.89,0; 4 -6.35,0; 5 -3.81,0; 6 -1.27,0; 7 1.27,0; 8 3.81,0; 9 6.35,0; 10 8.89,0; 11 11.43,0; 12 13.97,0
INDUCTOR_5045_SMALLTABS = smd 2 x 2.5: 1 -1.9,0 | smd 2 x 2.55: 2 1.9,0
SK6805_1515 = smd 0.5 x 0.5: 1 -0.5,-0.45; 2 0.5,-0.45; 3 0.5,0.45; 4 -0.5,0.45
DFN2015-3 = smd 0.5 x 0.31: 1 -0.95,0.5; 2 -0.95,-0.5 | smd 0.65 x 0.31: 3 0.825,0
BTN_RKB2_4.6X2.8 = smd 1 x 0.7: A 1.973,1.075; A' -1.973,1.075; B 1.973,-1.075; B' -1.973,-1.075
TESTPOINT_ROUND_1.5MM_NO = smd 1.5 x 1.5: P$1 0,0
USON8_4X4 = smd 0.6 x 0.4: 1 -1.85,1.2; 2 -1.85,0.4; 3 -1.85,-0.4; 4 -1.85,-1.2; 5 1.85,-1.2; 6 1.85,-0.4; 7 1.85,0.4; 8 1.85,1.2 | smd 2 x 3: PAD 0,0
SOT23-5 = smd 0.55 x 1.2: 1 -0.95,-1.3; 2 0,-1.3; 3 0.95,-1.3; 4 0.95,1.3; 5 -0.95,1.3
MOUNTINGHOLE_2.5_PLATED = drill 2.5 pad 3.2: P$1 0,0
FIDUCIAL_1MM = smd 1 x 1: 1 0,0
JSTPH2_BATT = smd 1 x 4.6: 1 -1,-2.049; 2 1,-2.049 | smd 1.6 x 3.4: NC1 -3.4,3.151; NC2 3.4,3.151
USB_HOST-SMT = smd 1 x 3: D+ 1,0.495; D- -1,0.495; GND 3.5,0.495; VBUS -3.5,0.495 | smd 2.2 x 6: MT1 -7.1,-2.413; MT2 7.1,-2.413 | hole 1.5: -2.5,-3.863; 2.5,-3.863
USB_C_CUSB31-CFM2AX-01-X = smd 0.575 x 1.15: A1B12 -3.2,2.275; A4B9 -2.4,2.275; B1A12 3.2,2.275; B4A9 2.4,2.275 | smd 0.275 x 1.15: A5 -1.25,2.275; A6 -0.25,2.275; A7 0.25,2.275; A8 1.25,2.275; B5 1.75,2.275; B6 0.75,2.275; B7 -0.75,2.275; B8 -1.75,2.275 | drill 0.6 pad 1 long: M1 -4.32,1.7; M2 4.32,1.7; M3 -4.32,-2.48; M4 4.32,-2.48 | hole 0.65: 2.89,1.2; -2.89,1.2
CRYSTAL_2.5X2 = smd 0.9 x 0.75: 1 -0.825,-0.625; 2 0.825,-0.625; 3 0.825,0.625; 4 -0.825,0.625

### Placement (x,y rotation side)
C1  19.94,18.63 0 top
C2  12.73,11.56 90 top
C3  12.64,9.53 270 top
C4  14.67,13.38 180 top
C5  29.01,13.37 270 top
C6  28.57,11.18 180 top
C7  28.32,9.08 180 top
C8  28.32,8.19 0 top
C9  14.1,8.45 180 top
C10  23.06,18.98 180 top
C11  12.7,4.45 90 top
C12  23.05,17.65 180 top
C13  27.5,7.3 0 top
C14  16.76,10.29 180 top
C15  17.46,12.83 90 top
C17  28.26,10.29 0 top
C18  16.76,9.4 0 top
C19  36.13,4.25 180 top
C20  10.22,12.13 180 top
C21  36.96,15.88 0 top
C22  36.13,6.06 180 top
C26  36.96,8.26 0 top
C27  37.21,12.45 180 top
C28  36.96,13.97 0 top
CHG  1.91,5.4 270 top
CONN1  33.08,16.32 270 top
D3  20.26,4.19 0 top
D4  5.71,20.13 90 top
D+1  1.46,10.22 0 bottom
D-1  1.4,12.83 0 bottom
IC1  22.29,10.16 270 top
IC2  36.96,9.78 270 top
JP1  25.4,1.27 180 top
JP3  30.48,21.65 0 top
L  1.82,17.42 90 top
L1  33.02,9.78 270 top
L2  39.18,19.05 270 top
LED1  27.23,5.46 270 top
PLABEL0  [PLABEL0]  16.07,7.37 0 top
PLABEL1  [PLABEL1]  9.78,7.37 0 top
PLABEL2  [PLABEL2]  3.8,5.51 90 top
PLABEL3  [PLABEL3]  3.54,17.26 90 top
PLABEL4  [PLABEL4]  6.35,2.79 0 top
PLABEL5  [PLABEL5]  13.97,2.79 0 top
PLABEL6  [PLABEL6]  16.51,2.79 0 top
PLABEL7  [PLABEL7]  19.05,2.79 0 top
PLABEL8  [PLABEL8]  21.59,2.79 0 top
PLABEL9  [PLABEL9]  24.13,2.79 0 top
PLABEL10  [PLABEL10]  26.67,2.79 0 top
PLABEL11  [PLABEL11]  29.21,2.79 0 top
PLABEL12  [PLABEL12]  27.69,20.57 0 top
PLABEL13  [PLABEL13]  24.13,20.19 0 top
PLABEL14  [PLABEL14]  21.59,20.19 0 top
PLABEL15  [PLABEL15]  19.05,20.19 0 top
PLABEL16  [PLABEL16]  16.51,20.19 0 top
PLABEL17  [PLABEL17]  10.29,2.79 0 top
PLABEL18  [PLABEL18]  36.39,17.27 0 top
PLABEL19  [PLABEL19]  31.75,2.79 0 top
PLABEL20  [PLABEL20]  34.29,2.79 0 top
PLABEL21  [PLABEL21]  36.83,2.79 0 top
PLABEL22  [PLABEL22]  39.37,2.79 0 top
PLABEL23  [PLABEL23]  43.12,2.48 0 top
PLABEL24  [PLABEL24]  45.47,2.48 0 top
PLABEL25  [PLABEL25]  34.29,20.19 0 top
PLABEL26  [PLABEL26]  36.83,20.19 0 top
PLABEL27  [PLABEL27]  39.37,20.19 0 top
PLABEL28  [PLABEL28]  41.91,20.19 0 top
PLABEL29  [PLABEL29]  46.04,21.27 90 top
PLABEL30  [PLABEL30]  30.23,20.57 0 top
PLABEL31  [PLABEL31]  31.75,20.32 0 top
PLABEL32  [PLABEL32]  31.75,2.79 0 bottom
PLABEL33  [PLABEL33]  34.29,2.79 0 bottom
PLABEL34  [PLABEL34]  36.83,2.79 0 bottom
PLABEL35  [PLABEL35]  39.37,2.79 0 bottom
PLABEL36  [PLABEL36]  41.91,2.79 0 bottom
PLABEL37  [PLABEL37]  41.91,20.19 0 bottom
PLABEL38  [PLABEL38]  44.96,20.19 0 bottom
PLABEL39  [PLABEL39]  39.37,20.19 0 bottom
PLABEL40  [PLABEL40]  36.83,20.19 0 bottom
PLABEL41  [PLABEL41]  34.29,20.19 0 bottom
PLABEL42  [PLABEL42]  31.62,20.13 0 bottom
PLABEL43  [PLABEL43]  6.29,2.86 0 bottom
PLABEL44  [PLABEL44]  13.91,2.86 0 bottom
PLABEL45  [PLABEL45]  16.45,2.86 0 bottom
PLABEL46  [PLABEL46]  18.86,2.86 0 bottom
PLABEL47  [PLABEL47]  21.65,2.86 0 bottom
PLABEL48  [PLABEL48]  24.07,2.86 0 bottom
PLABEL49  [PLABEL49]  26.61,2.86 0 bottom
PLABEL50  [PLABEL50]  29.15,2.86 0 bottom
PLABEL51  [PLABEL51]  9.97,2.86 0 bottom
PLABEL52  [PLABEL52]  26.48,20.19 0 bottom
PLABEL53  [PLABEL53]  23.94,20.19 0 bottom
PLABEL54  [PLABEL54]  21.53,20.07 0 bottom
PLABEL55  [PLABEL55]  18.99,20.07 0 bottom
PLABEL56  [PLABEL56]  16.07,20.07 0 bottom
PLABEL57  [PLABEL57]  29.02,20.19 0 bottom
PLABEL58  [PLABEL58]  50.67,14.1 0 bottom
PLABEL59  [PLABEL59]  9.53,19.81 0 bottom
PLABEL60  [PLABEL60]  50.42,8.13 0 bottom
PLABEL61  [PLABEL61]  44.32,2.79 0 bottom
PLABEL62  [PLABEL62]  32.51,7.68 0 bottom
Q3  20.38,16.85 0 top
R1  16.76,8.45 0 top
R2  5.71,4 0 top
R3  16.64,19.01 0 top
R4  5.71,4.95 180 top
R5  24.59,18.68 90 top
R6  16.76,11.18 0 top
R7  5.14,17.84 180 top
R8  7.71,9.02 90 top
R9  7.75,13.65 90 top
R10  7.75,11.75 270 top
R11  22.67,4.19 270 top
R12  5.71,5.91 180 top
R13  5.14,16.95 180 top
R14  29.46,6.1 270 top
R15  38.29,8.61 90 top
R16  38.29,10.73 90 top
R17  31.31,3.81 180 top
R18  31.31,5.14 180 top
R19  38.8,5.4 270 top
R20  39.18,17.78 180 top
SW1  9.53,5.08 180 top
SW2  15.88,5.08 180 top
TP3  11.43,5.08 0 bottom
U1  27.62,17.91 0 top
U2  16.89,16.45 180 top
U3  10.12,9.53 90 top
U$13  [PCBFEAT-REV-040]  4,11.24 0 bottom
U$31  2.54,20.32 270 top
U$32  2.54,2.54 270 top
U$34  10.79,20.45 270 top
U$35  46.28,0.77 270 top
U$43  [ADAFRUIT_2.5MM]  28.07,13.34 90 top
U$46  [FEATHERLOGO_MED]  23.88,5.97 0 bottom
U$47  [ADAFRUIT_5MM]  21.08,13.97 0 bottom
X1  10.92,17.65 0 top
X2  41.15,11.43 90 top
X6  3.87,11.43 270 top
Y1  14.48,10.73 90 top

### Tracks (layer width: path | path; a pad name or v marks a point on that pad's centre or on a via)
1.2V  (via drill 0.3)
  Top 0.178: C18.2 17.43,9.56 IC1.23 19.4,9.56 19.97,8.98 v19.81,8.83 | C6.2 27.62,11.18 26.88,10.44 26.33,10.44 26.25,10.36 IC1.50 25.22,10.36 25.02,10.16 25.02,8.76 | 25.02,8.76 25.02,8.57 25.03,8.56 25.03,8.55 25.22,8.36 IC1.45 26.25,8.36 26.44,8.17 26.44,8.16 26.47,8.14 27.32,8.14 27.81,8.64 C7.2 C8.1 | v24.85,8.83 24.96,8.83 25.02,8.76
  Bottom 0.178: v24.85,8.83 v19.81,8.83
5.0V
  Top 0.254: C26.2 IC2.6 37.5,9.1 37.5,8.19 37.59,8.1 R15.1
  Top 0.406: C19.1 37.22,4.39 37.08,4.48 C22.1 | C19.1 36.96,4.31 37.27,4.46 37.27,6.22 37.47,6.41 C26.2 | C19.1 37.27,4.45 R19.2
5V_EN  (via drill 0.3, 0.35)
  Top 0.178: v18.73,6.92 18.77,6.96 19.43,6.96 IC1.29 | 28.83,4.71 28.83,4.77 | v28.89,4.76 28.83,4.71 | 28.83,4.71 28.77,4.64 28.77,5.09 29.27,5.59 R14.2 29.65,5.78 32.38,5.78 32.58,5.59 v32.77,5.59 | v37.08,11.3 36.96,11.18 IC2.2
  Bottom 0.178: v18.73,6.92 18.22,6.41 18.22,4.62 19.73,3.12 27.43,3.12 28.77,4.47 28.77,4.65 v28.89,4.76 | v32.77,5.59 32.77,5.52 33.97,4.32 40.4,4.32 42.47,6.39 42.47,9.54 40.7,11.3 v37.08,11.3
!RESET
  Top 0.178: IC1.26 18.14,8.36 17.92,8.58 17.41,8.58 R1.2 16.51,7.68 13.53,7.68 12.83,6.99 11.05,6.99 9.34,5.27 9.34,4 | 9.34,4 SW1.A 6.35,2.8 JP1.16 | 9.34,4 SW1.A'
+3V3  (via drill 0.35, 0.38, 0.39, 0.4)
  Top 0.178: C14.1 17.65,10.29 17.98,9.96 IC1.22 19.68,9.96 v20.1,10.38 20.38,10.1 20.38,8.26 20.43,8.21 21.29,8.21 21.29,8.02 | IC1.48 IC1.49 26.36,9.96 26.48,10.08 27.55,10.08 C17.1 27.75,10.03 28.07,9.72 29.27,9.72 29.53,9.46 29.53,7.05 29.1,6.62 | IC1.43 IC1.44 24.98,7.96 24.68,8.26 24.26,8.26 | 26.94,7.25 26.63,7.56 IC1.43 | IC1.42 24.89,7.09 25.36,7.56 IC1.43 | U1.8 28.89,19.68 25.46,19.68 24.97,19.19 R5.2 23.78,19.19 C10.1 23.56,18.97 C12.1 24.03,17.18 24.03,16.07 24.49,15.6 | C11.1 12.63,2.47 JP1.14 JP1.15 | IC1.33 21.29,8.02 | 24.26,8.26 21.53,8.26 21.29,8.02 | 24.26,8.26 24.26,10.54 24.26,12.06 | 24.26,12.06 24.26,12.45 24.89,13.08 IC1.1 25.56,13.61 25.73,13.78 25.73,14.92 25.58,15.07 25.02,15.07 24.49,15.6 | 24.26,12.06 23.37,12.06 22.56,12.87 21.45,12.87 21.29,13.04 IC1.10 | U2.5 17.78,15.21 | C9.1 15.43,8.45 v15.43,8.32 15.56,8.45 R1.1 | 26.94,7.25 C13.1 | 24.49,15.6 24.36,15.47 v24.29,15.47 | 29.1,6.62 27.57,6.62 26.94,7.25 | R14.1 29.12,6.6 29.1,6.62
  Top 0.254: 17.78,15.21 17.51,15.21 17.39,15.34 16.8,15.34 16.52,15.06 16.52,14.38 15.62,13.48 | v16.66,12.33 17.45,12.33 C15.1
  Top 0.305: v16.66,12.33 16.66,12.34 C4.1 15.62,13.48 | v24.45,10.4 24.31,10.54 24.26,10.54
  Top 0.406: C5.1 29.01,14.53 29.21,14.73 29.65,14.73 30.55,15.63 v30.61,15.63 30.8,15.82 CONN1.2
  Bottom 0.305: JP1.14 13.08,2.92 13.78,2.92 15.3,4.45 15.3,8.19 v15.43,8.32 15.37,8.38 15.37,11.04 v16.66,12.33 17.11,12.33 19.06,10.38 v20.1,10.38 20.28,10.57 24.32,10.57 24.45,10.44 v24.45,10.4
  Bottom 0.406: v24.29,15.47 24.45,15.63 v30.61,15.63
A0
  Top 0.178: IC1.38 23.29,3.19 22.83,2.73 20.98,2.73 20.63,2.38 17.61,2.38 JP1.12
A1
  Top 0.178: IC1.39 23.69,3.02 23.04,2.38 21.13,2.38 20.03,1.27 JP1.11
A2
  Top 0.178: JP1.10 22.54,1.27 24.09,2.82 IC1.40
A3
  Top 0.178: IC1.41 24.49,1.63 JP1.9
CC1
  Top 0.178: X6.A5 3.83,12.68 3.27,13.24 3.27,15.46 4.64,16.83 R13.2
CC2
  Top 0.178: R12.2 4.38,5.91 3.81,6.48 3.81,7.94 3.27,8.49 3.27,9.36 3.6,9.69 5.55,9.69 5.56,9.68 X6.B5
D4  (via drill 0.3)
  Top 0.178: IC1.6 22.89,13.09 23.37,12.61 v23.62,12.61 | v38.21,2.83 38.15,2.77 30.06,2.77 v30,2.83
  Bottom 0.178: v23.62,12.61 23.71,12.52 29.21,12.52 30.32,11.41 30.32,3.15 v30,2.83 | v38.21,2.83 38.21,2.82 41.92,2.82 42.82,1.92 43.8,1.92 JP1.1
D5  (via drill 0.3)
  Top 0.178: v22.73,16 22.87,15.86 22.87,14.63 22.49,14.24 IC1.7
  Bottom 0.178: v22.73,16 22.14,16.59 22.14,17.31 23.5,18.67 27.35,18.67 28.16,19.48 30.11,19.48 30.46,19.84 34.54,19.84 35.21,20.51 38.23,20.51 JP3.10
D6  (via drill 0.3)
  Top 0.178: v22.29,15.24 22.09,15.04 IC1.8
  Bottom 0.178: v22.29,15.24 22.23,15.24 22.16,15.3 22.16,16.07 21.78,16.45 21.78,17.47 23.33,19.02 27.2,19.02 28.01,19.84 29.96,19.84 30.32,20.19 34.39,20.19 35.41,21.21 36.39,21.21 JP3.9
D9  (via drill 0.3)
  Top 0.178: v20.51,15.56 20.49,15.54 IC1.12
  Bottom 0.178: v20.51,15.56 20.51,16.19 21.34,17.02 21.34,17.53 21.33,17.53 23.18,19.38 27.05,19.38 27.87,20.19 29.82,20.19 30.17,20.55 32.21,20.55 33.31,21.65 JP3.8
D10  (via drill 0.3)
  Top 0.178: IC1.13 20.09,14.71 19.88,14.92 v19.88,15.05
  Bottom 0.178: v19.88,15.05 19.88,16.07 20.89,17.08 20.89,17.59 23.04,19.74 26.91,19.74 27.72,20.55 29.67,20.55 30.77,21.65 JP3.7
D11  (via drill 0.3)
  Top 0.178: IC1.14 19.69,14.41 19.11,14.99 v19.11,15.18
  Bottom 0.178: v19.11,15.18 19.11,15.81 20.45,17.14 20.45,17.66 22.88,20.09 26.76,20.09 28.32,21.65 JP3.6
D12  (via drill 0.3)
  Top 0.178: IC1.15 19.32,13.24 19.32,14.12 18.81,14.63 v18.62,14.63
  Bottom 0.178: v18.62,14.63 18.5,14.76 18.5,15.7 20.09,17.3 20.09,17.8 22.73,20.45 24.57,20.45 25.78,21.65 JP3.5
D13  (via drill 0.3)
  Top 0.178: IC1.16 18.1,12.36 18.1,13.14 18.41,13.14 18.73,13.46 v18.73,13.91 | R7.1 6.48,17.84 v6.54,17.78
  Bottom 0.178: v6.54,17.78 8.45,17.78 10.86,15.37 17.12,15.37 18.03,14.45 | v18.73,13.91 18.58,13.91 18.03,14.45 | JP3.4 24.13,21.63 23.3,20.8 22.59,20.8 19.74,17.95 19.74,17.45 18.03,15.75 18.03,14.45
D24  (via drill 0.3)
  Top 0.178: IC1.36 22.49,7.44 22.44,7.49 22.44,7.52 v22.25,7.71 | v25.48,6.75 25.48,6.37 24.89,5.78 24.89,3.05 JP1.8
  Bottom 0.178: v22.25,7.71 22.44,7.52 22.44,7.49 22.76,7.17 25.06,7.17 v25.48,6.75
D25  (via drill 0.3)
  Top 0.178: IC1.37 22.89,7.61 v22.99,7.71 | v26.19,6.95 26.19,6.55 25.27,5.64 25.27,3.24 26.1,2.41 27.11,2.41 28.26,1.27 JP1.7
  Bottom 0.178: v26.19,6.95 26.19,7.07 25.54,7.72 23,7.72 v22.99,7.71
D+  (via drill 0.3)
  Top 0.178: IC1.47 25.77,9.19 26.29,9.19 26.55,9.45 v26.79,9.45 | v7.72,10.48 7.72,11.21 R10.2
  Bottom 0.178: v26.79,9.45 25.26,10.99 19.05,10.99 17.1,12.94 8.21,12.94 7.72,12.45 v7.72,10.48
D-  (via drill 0.3)
  Top 0.178: IC1.46 26.86,8.76 v26.92,8.69 | v8.51,13.97 8.32,14.16 R9.2
  Bottom 0.178: v26.92,8.69 27.37,9.14 27.37,9.71 25.7,11.38 19.16,11.38 17.23,13.31 9.17,13.31 v8.51,13.97
EN
  Top 0.178: U2.3 16.13,17.93 R3.1 16.13,19.37 18.41,21.65 JP3.2
FB
  Top 0.178: IC2.1 38.09,10.41 38.19,10.31 R16.1 R15.2
  Top 0.254: R16.1 38.19,10.31
GND  (via drill 0.4)
  Top 0.178: IC1.19 20.97,11.16 21.02,11.11
  Top 0.305: X1.NC1 6.85,20.13 v5,20.13 | C3.1 12.52,10.03 12.01,9.53 U3.2 | U1.4 27.25,16.71 v27.56,17.02 27.62,17.08 U1.PAD | C18.1 15.98,9.12 13.82,9.12 13.59,8.89 C9.2 13.13,8.45 13.07,8.39 12.83,8.39 v12.64,8.19 | C15.2 17.46,13.92 17.14,14.24 v17.14,14.26 | IC1.P$1 21.65,10.16 v21.14,9.65 | R12.1 7.3,5.91 SW1.B | R8.2 7.37,9.53 7.07,9.23 7.07,8.6 6.71,8.23 | X6.B1A12 6.71,8.23 | 6.71,8.23 6.76,8.23 7.18,7.81 9.78,7.81 9.97,8 v9.97,9.21 | C20.2 9.78,12.63 9.78,14.96 9.92,15.1 X1.1 | R16.2 38.34,11.24 38.82,10.76 38.82,11.07 39.02,11.26 42.46,11.26 43.24,10.47 43.24,9.97 42.87,9.6 39.02,9.6 38.88,9.74
  Top 0.406: 21.02,11.11 20.95,11.11 21.46,10.6 21.84,10.6 IC1.P$1
  other vias: 11.62,21.91 8.57,6.48 9.97,4.64 12.7,6.22 16.13,5.78 23.5,9.65 28.89,7.37 13.84,16 16.89,16.57 14.73,14.67 8.64,4.7 14.61,5.21 22.29,12.27 2.22,11.62 1.33,8.32 1.14,14.22 7.24,16.89 7.3,15.05 10.3,10.93 19.94,19.88 12.45,19.18 14.35,17.53 32.26,15.05 32.19,17.27 31.31,17.78 28.64,5.91 29.72,10.41 36.32,7.37 40.26,6.1 41.66,6.48 39.56,9.27 39.5,13.65 38.61,12.38 34.67,13.27 33.15,13.4 33.53,9.78 34.99,10.35 39.5,16.13 41.66,16.13 43.12,14.48 41.78,13.72 37.08,17.27 33.27,6.35 41.72,9.27 42.48,11.43 35.18,7.62 33.85,5.46 46.1,6.92 48.51,9.59 48.9,12.64 45.97,11.81 48.58,14.86 45.28,15.81 49.28,18.03 49.59,4.45 43.88,6.6
  pour Top: 0,22.86 50.8,22.86 50.8,0 0,0
  pour Bottom: 0,22.86 50.8,22.86 50.8,0 0,0
MISO  (via drill 0.3)
  Top 0.178: v21.55,15.23 21.36,15.23 20.89,14.76 IC1.11
  Bottom 0.178: v21.55,15.23 21.55,15.17 22.06,14.66 22.06,14.34 22.5,13.9 24.41,13.9 24.72,13.59 30.1,13.59 31.43,12.26 31.43,2.92 31.62,2.73 32.35,2.73 32.67,2.41 34.8,2.41 35.94,1.27 JP1.4
MOSI  (via drill 0.3)
  Top 0.178: IC1.18 19.69,11.56 20.13,12 v20.13,12.32
  Bottom 0.178: v20.13,12.32 20.2,12.32 21.41,13.53 24.28,13.53 24.57,13.23 29.75,13.23 31.03,11.96 31.03,2.82 31.47,2.38 32.21,2.38 33.31,1.27 JP1.5
N$1
  Top 0.178: CHG.C 3.11,5.4 4.51,4 R2.1
N$2
  Top 0.178: L.A 2.99,17.84 R7.2
N$3
  Top 0.178: R2.2 6.29,4 6.92,4.64 7.62,4.64 11.42,8.44 U3.1
N$4
  Top 0.178: U3.5 8.76,8.51 R8.1
N$5
  Top 0.178: C2.2 13.35,12.06 Y1.3 13.85,12 14.17,12.32 15.56,12.32 16.13,11.74 17.68,11.74 17.84,11.59 17.84,11.24 18.32,10.76 IC1.20
N$6
  Top 0.178: R6.1 16.04,11.18 15.1,10.24 15.1,10.03 | 15.1,10.03 Y1.1 | C3.2 12.79,9.02 13.21,9.44 13.21,10.47 13.37,10.62 14.51,10.62 15.1,10.03
N$7
  Top 0.178: R6.2 17.47,10.98 17.55,10.98 18.18,10.36 IC1.21
N$8  (via drill 0.3)
  Top 0.178: v32.75,4.01 32.69,4.06 32.07,4.06 R17.1 | v43.12,12.26 43.04,12.18 X2.D+
  Bottom 0.178: v32.75,4.01 33.23,3.53 40.62,3.53 43.18,6.1 43.18,12.19 v43.12,12.26
N$9  (via drill 0.3)
  Top 0.178: R18.1 31.81,4.92 31.96,4.77 v32.73,4.77 | X2.D- 42.59,10.18 v42.64,10.22
  Bottom 0.178: v42.64,10.22 42.82,10.04 42.82,6.24 40.52,3.94 33.62,3.94 32.79,4.77 v32.73,4.77
N$10
  Top 0.178: X2.VBUS 42.22,7.93 44.2,9.91 44.2,13.2 43.92,13.48 43.92,15.64 42.48,17.08 40.39,17.08 R20.1
  Top 0.406: R19.1 40.38,7.93 X2.VBUS
N$11
  Top 0.178: L2.A 38.64,19.09 38.64,19.08 38.67,19.05 R20.2
N$16
  Top 0.178: R11.2 21.74,3.68 D3.A
NEOPIX_PWR  (via drill 0.3)
  Top 0.178: IC1.31 20.49,6.08 v19.84,5.43 | LED1.2 26.83,4.91 v26.83,4.12
  Bottom 0.178: v19.84,5.43 19.84,5.04 21.02,3.86 26.64,3.86 26.64,3.93 v26.83,4.12
NEOPIXEL  (via drill 0.3)
  Top 0.178: LED1.1 26.52,5.96 25.91,5.34 25.91,4.51 v25.97,4.45 | IC1.32 v20.89,5.59 v20.88,5.59
  Bottom 0.178: v25.97,4.45 25.78,4.25 21.27,4.25 20.88,4.64 v20.88,5.59
QSPI_CS  (via drill 0.3)
  Top 0.178: 24.38,16.21 25.17,15.43 25.96,15.43 26.09,15.3 26.09,13.11 IC1.56 25.15,12.76 24.8,12.42 v24.8,11.94 | R11.1 22.72,4.75 v22.72,5.77 | 24.38,16.21 24.38,16.64 24.38,17.84 24.38,17.97 R5.1 24.65,18.17 25.58,19.11 U1.1 | 24.38,16.21
  Bottom 0.178: v22.72,5.77 22.77,5.71 27.3,5.71 27.75,6.16 27.75,9.97 25.91,11.81 24.93,11.81 v24.8,11.94
QSPI_DATA[0]
  Top 0.178: U1.5 29.35,16.71 28.7,16.07 27.17,16.07 27.15,16.05 27.15,12.26 26.49,11.59 25.77,11.59 IC1.53
QSPI_DATA[1]
  Top 0.178: U1.2 25.64,18.31 25.2,17.86 25.2,17.67 24.74,17.21 24.74,16.36 25.32,15.79 26.29,15.79 26.44,15.63 26.44,12.55 26.25,12.36 IC1.55
QSPI_DATA[2]
  Top 0.178: IC1.54 26.36,11.96 26.8,12.4 26.8,16 26.66,16.14 25.46,16.14 25.15,16.46 25.15,17.02 25.64,17.51 U1.3
QSPI_DATA[3]
  Top 0.178: U1.7 29.59,18.31 30.42,17.48 30.42,16.27 29.5,15.35 27.88,15.35 27.86,15.34 27.86,11.96 26.7,10.79 25.77,10.79 IC1.51
QSPI_SCK
  Top 0.178: U1.6 29.8,17.51 30.04,17.27 30.04,16.4 29.35,15.71 27.51,15.71 27.51,12.11 26.56,11.16 IC1.52
RX  (via drill 0.3)
  Top 0.178: IC1.3 24.09,14.51 v24.26,14.69
  Bottom 0.178: v24.26,14.69 24.62,14.32 24.62,14.28 24.94,13.96 30.24,13.96 31.81,12.39 31.81,3.15 31.88,3.09 32.5,3.09 32.77,2.82 36.84,2.82 38.39,1.27 JP1.3
SCK  (via drill 0.3)
  Top 0.178: v21.08,12.43 20.63,12.87 19.76,12.87 19.56,12.67 19.56,12.06 19.45,11.96 IC1.17
  Bottom 0.178: JP1.6 30.67,2.35 30.67,11.68 29.48,12.88 24.43,12.88 24.13,13.17 21.82,13.17 v21.08,12.43
SCL  (via drill 0.3, 0.35)
  Top 0.178: v22.72,16.81 23.29,16.25 IC1.5 | CONN1.4 34.01,18.47 v34.92,19.39
  Bottom 0.178: v22.72,16.81 22.98,17.07 22.98,17.65 23.64,18.31 27.5,18.31 28.31,19.13 30.26,19.13 30.56,19.43 34.92,19.43 | JP3.11 40.93,21.65 39.83,20.55 39.28,20.55 38.16,19.43 34.92,19.43 | v34.92,19.39 34.92,19.43
SDA  (via drill 0.3, 0.35)
  Top 0.178: v23.48,16.86 23.67,16.67 23.67,13.63 IC1.4 | CONN1.3 34.92,16.82 35.26,17.16 v35.26,18.16
  Bottom 0.178: v23.48,16.86 23.48,17.56 23.88,17.96 27.64,17.96 28.46,18.77 35.34,18.77 | 35.34,18.77 38.24,18.77 39.47,20 42.8,20 JP3.12 | v35.26,18.16 35.26,18.7 35.34,18.77
SW
  Top 0.178: IC2.5 36.96,9.65 36.83,9.78 36.01,9.78
  Top 0.406: 36.01,9.78 34.1,7.88 L1.2
TX  (via drill 0.3)
  Top 0.178: IC1.2 24.49,14.14 24.85,14.5 v25.16,14.5
  Bottom 0.178: v25.16,14.5 25.29,14.38 30.46,14.38 32.17,12.66 32.17,3.53 32.26,3.44 32.67,3.44 32.94,3.17 37.02,3.17 37.91,2.29 38.8,2.29 38.98,2.46 40.72,2.46 JP1.2
USB_D+  (via drill 0.3)
  Top 0.178: 6.91,11.68 7.49,12.26 R10.1 | X6.A6 6.91,11.68 | 6.91,11.68 7.11,11.48 7.11,10.92 6.87,10.68 X6.B6 5.07,10.68 4.49,11.26 3.67,11.26 v2.65,10.24
  Bottom 0.178: v2.65,10.24 2.63,10.22 D+1.TP
USB_D-  (via drill 0.3)
  Top 0.178: X6.A7 5.2,11.18 5.08,11.3 5.08,11.94 5.32,12.18 X6.B7 | X6.B7 6.18,12.15 6.71,12.15 6.99,12.43 6.99,12.89 7.24,13.14 R9.1 | X6.B7 3.12,12.18 v2.67,12.64
  Bottom 0.178: v2.67,12.64 1.59,12.64 D-1.TP
USBBOOT  (via drill 0.3)
  Top 0.178: D3.C 19.22,4 SW2.A' SW2.A 13.9,4.83 v13.84,4.89 | IC1.9 21.69,14.25 v21.43,14.51
  Bottom 0.178: v13.84,4.89 13.84,4.95 13.21,5.59 11.49,5.59 11.43,5.52 | TP3.P$1 11.43,5.52 | v21.43,14.51 20.61,13.68 19.98,13.68 19.15,12.85 18.22,12.85 17.41,13.66 9.64,13.66 8.76,14.54 8.19,14.54 6.92,13.27 6.92,10.03 7.23,9.72 8,9.72 8.64,10.35 9.97,10.35 10.67,9.65 10.67,9.59 11.43,8.83 11.43,5.52
USBH_D+  (via drill 0.3)
  Top 0.178: IC1.27 18.03,7.96 v17.9,7.83 | R17.2 29.91,3.81 v29.72,4
  Bottom 0.178: v17.9,7.83 17.33,7.26 17.33,4.39 19.34,2.38 27.9,2.38 29.53,4 v29.72,4
USBH_D-  (via drill 0.3)
  Top 0.178: IC1.28 18.43,7.56 v17.97,7.1 | R18.2 30.67,5.02 30.35,5.02 30.07,4.74 v29.72,4.74
  Bottom 0.178: v17.97,7.1 17.68,6.81 17.68,4.54 19.45,2.77 27.69,2.77 29.65,4.74 v29.72,4.74
VBAT
  Top 0.305: U3.3 11.17,10.72 C20.1 11.17,12.87 11.92,13.61 X1.2 11.92,15.8 12.83,16.7 14.92,16.7 15.23,16.4 | JP3.1 16.51,20.59 15.45,19.53 15.45,18.84 15.23,18.61 15.23,16.4 | 15.23,16.4 15.49,16.13 16.32,16.13 16.57,15.88 17.23,15.88 17.43,16.08 18.66,16.08 18.92,15.81 19.81,15.81 20.38,16.38 20.38,16.7 20.54,16.85 Q3.3
VBUS  (via drill 0.38, 0.4)
  Top 0.305: X6.A4B9 5.62,13.83 5.38,13.59 4.19,13.59 v3.94,13.84 | X6.B4A9 5.62,9.03 5.38,9.27 4.45,9.27 v3.94,8.76 | 2.79,6.22 1.16,6.22 CHG.A | 2.79,6.22 3.05,6.48 3.05,8.11 2.85,8.31 2.85,9.58 v3.94,10.67 | v4.76,18.73 5.16,19.13 D4.A | R4.2 4.51,4.95 3.24,6.22 2.79,6.22 | U3.4 v8.83,9.65 | Q3.1 19.42,17.34 v18.67,17.34
  Bottom 0.305: 3.94,9.53 v3.94,10.67 v3.94,13.84 3.94,17.59 4.83,18.48 | 3.94,9.53 v3.94,8.76 | 4.83,18.48 4.83,18.67 v4.76,18.73 | 4.83,18.48 5.4,19.05 10.22,19.05 10.99,18.29 18.61,18.29 | JP3.3 21.59,20.45 19.43,18.29 18.61,18.29 | 3.94,9.53 6.83,9.53 7.06,9.3 8.47,9.3 v8.83,9.65 | 18.61,18.29 18.67,18.22 v18.67,17.34
VHI  (via drill 0.39)
  Top 0.178: R3.2 17.69,19.01 17.84,18.86 U2.1 | 17.92,17.67 U2.1 | C1.1 18.73,18.63 U2.1
  Top 0.203: Q3.2 19.21,16.57 18.16,16.57 17.92,16.82 17.92,17.67
  Top 0.254: IC2.3 36.46,10.66 36.2,10.92 | v17.75,20.09 19.26,20.09 19.68,20.51 20.2,20.51 20.52,20.19 21.27,20.19
  Top 0.305: D4.C 5.51,21.34 v4.7,21.34 | v17.75,20.09 17.14,19.48 R3.2
  Top 0.406: L1.1 33.15,11.55 35.31,11.55 36.2,10.67 36.2,10.92 36.2,11.94 | C27.2 36.2,11.94 | 36.2,11.94 36.2,13.78 C28.1 C21.1
  Top 0.508: 21.27,20.19 25.23,20.19 25.42,20.38 34.98,20.38 36.17,19.19 36.17,16.04 C21.1
  Bottom 0.305: v4.7,21.34 5.27,21.34 6.22,20.38 14.67,20.38 15.15,19.9 17.56,19.9 v17.75,20.09

### Text on the board
tPlace: 5V
Pinguin_tBackup: 12 | 11 | SDA | Bat | EN | USB | 13 | 10 | 9 | 6 | 5 | SCL | #13 | I2C | Reset | Boot | chg | Rst | 3.3V | GND | A0 | A1 | A2 | A3 | 24 | 25 | SCK | MO | MI | RX | TX | 4
Pinguin_bBackup: 3.7V/4.2V / LiPoly Battery / USB Charge | Bat | EN | USB | 13 | 12 | 11 | 10 | 9 | 6 | 5 | SCL | SDA | Adafruit RP2040 / Feather with USB Host | D+ 16 / D- 17 / 5Ven 18 | Rst | 3.3V | GND | A0 | A1 | A2 | A3 | 24 | 25 | SCK | MO | MI | RX | TX | 4